# Altium schematic sheet PCIe_USB.SchDoc: PCIe_USB
size A3; Author: Silard Gal; SheetNumber: 4; SheetTotal: 7
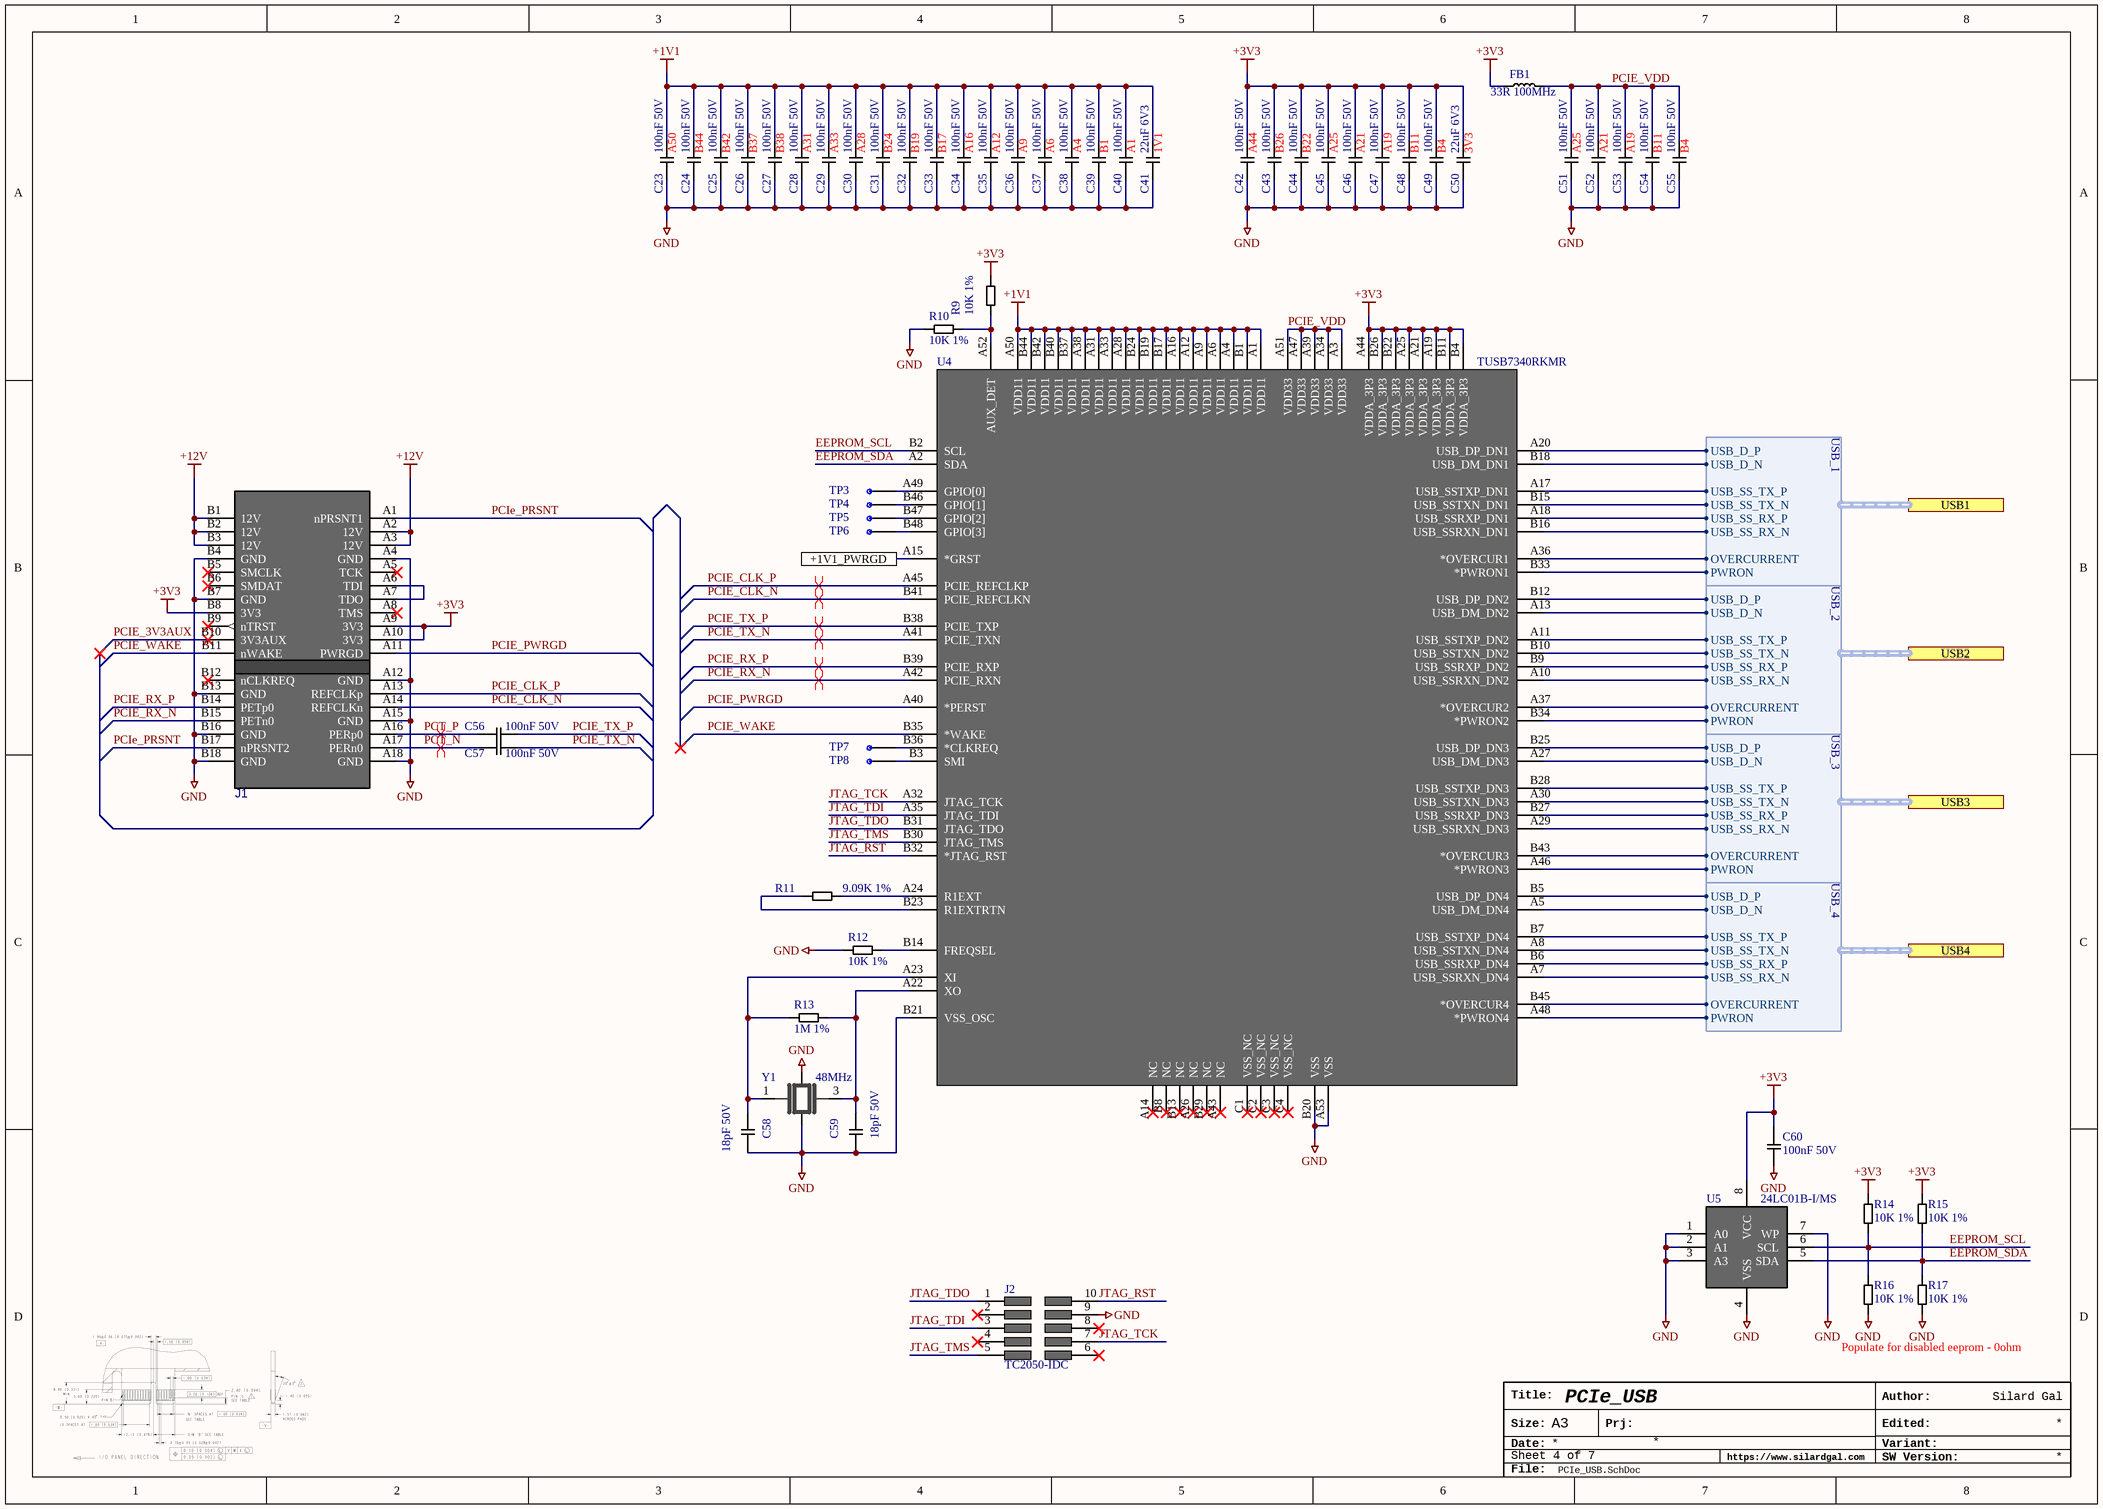
[diagram p0: PCIe_USB.SchDoc]

## Parts
C23  100nF 50V  [CAPC1608X06N]
C24  100nF 50V  [CAPC1608X06N]
C25  100nF 50V  [CAPC1608X06N]
C26  100nF 50V  [CAPC1608X06N]
C27  100nF 50V  [CAPC1608X06N]
C28  100nF 50V  [CAPC1608X06N]
C29  100nF 50V  [CAPC1608X06N]
C30  100nF 50V  [CAPC1608X06N]
C31  100nF 50V  [CAPC1608X06N]
C32  100nF 50V  [CAPC1608X06N]
C33  100nF 50V  [CAPC1608X06N]
C34  100nF 50V  [CAPC1608X06N]
C35  100nF 50V  [CAPC1608X06N]
C36  100nF 50V  [CAPC1608X06N]
C37  100nF 50V  [CAPC1608X06N]
C38  100nF 50V  [CAPC1608X06N]
C39  100nF 50V  [CAPC1608X06N]
C40  100nF 50V  [CAPC1608X06N]
C41  22uF 6V3  [CAPC1608X06N]
C42  100nF 50V  [CAPC1608X06N]
C43  100nF 50V  [CAPC1608X06N]
C44  100nF 50V  [CAPC1608X06N]
C45  100nF 50V  [CAPC1608X06N]
C46  100nF 50V  [CAPC1608X06N]
C47  100nF 50V  [CAPC1608X06N]
C48  100nF 50V  [CAPC1608X06N]
C49  100nF 50V  [CAPC1608X06N]
C50  22uF 6V3  [CAPC1608X06N]
C51  100nF 50V  [CAPC1608X06N]
C52  100nF 50V  [CAPC1608X06N]
C53  100nF 50V  [CAPC1608X06N]
C54  100nF 50V  [CAPC1608X06N]
C55  100nF 50V  [CAPC1608X06N]
C56  100nF 50V  [CAPC1005X06N]
C57  100nF 50V  [CAPC1005X06N]
C58  18pF 50V  [CAPC1608X06N]
C59  18pF 50V  [CAPC1608X06N]
C60  100nF 50V  [CAPC1608X06N]
FB1  33R 100MHz  [INDC1608X06N]
J1  PCIe x1  [CON FINGERS PCIEx1 1mm 36P PCB]  (value not drawn)  (no BOM)
J2  TC2050-IDC  [TAG_CONNECT]
R9  10K 1%  [RESC1608X06N]
R10  10K 1%  [RESC1608X06N]
R11  9.09K 1%  [RESC1608X06N]
R12  10K 1%  [RESC1608X06N]
R13  1M 1%  [RESC1608X06N]
R14  10K 1%  [RESC1608X06N]
R15  10K 1%  [RESC1608X06N]
R16  10K 1%  [RESC1608X06N]
R17  10K 1%  [RESC1608X06N]
TP3  TP  [TP]  (value not drawn)  (no BOM)
TP4  TP  [TP]  (value not drawn)  (no BOM)
TP5  TP  [TP]  (value not drawn)  (no BOM)
TP6  TP  [TP]  (value not drawn)  (no BOM)
TP7  TP  [TP]  (value not drawn)  (no BOM)
TP8  TP  [TP]  (value not drawn)  (no BOM)
U4  TUSB7340RKMR  [100-WQFN]
U5  24LC01B-I/MS  [SOP65P490X110-8N]
Y1  48MHz  [XTAL_ABM8G-48.000MHZ-18-D2Y-T]

## Ports
+1V1_PWRGD, USB1 (harness USB_1), USB2 (harness USB_2), USB3 (harness USB_3), USB4 (harness USB_4)

## Harnesses
USB_1: USB_D_P, USB_D_N, USB_SS_TX_P, USB_SS_TX_N, USB_SS_RX_P, USB_SS_RX_N, OVERCURRENT, PWRON
USB_2: USB_D_P, USB_D_N, USB_SS_TX_P, USB_SS_TX_N, USB_SS_RX_P, USB_SS_RX_N, OVERCURRENT, PWRON
USB_3: USB_D_P, USB_D_N, USB_SS_TX_P, USB_SS_TX_N, USB_SS_RX_P, USB_SS_RX_N, OVERCURRENT, PWRON
USB_4: USB_D_P, USB_D_N, USB_SS_TX_P, USB_SS_TX_N, USB_SS_RX_P, USB_SS_RX_N, OVERCURRENT, PWRON

## Nets
+1V1: C23.2 C24.2 C25.2 C26.2 C27.2 C28.2 C29.2 C30.2 C31.2 C32.2 C33.2 C34.2 C35.2 C36.2 C37.2 C38.2 C39.2 C40.2 C41.2 U4.A1(VDD11) U4.A4(VDD11) U4.A6(VDD11) U4.A9(VDD11) U4.A12(VDD11) U4.A16(VDD11) U4.A28(VDD11) U4.A31(VDD11) U4.A33(VDD11) U4.A38(VDD11) U4.A50(VDD11) U4.B1(VDD11) U4.B17(VDD11) U4.B19(VDD11) U4.B24(VDD11) U4.B37(VDD11) U4.B40(VDD11) U4.B42(VDD11) U4.B44(VDD11)
+3V3: C42.2 C43.2 C44.2 C45.2 C46.2 C47.2 C48.2 C49.2 C50.2 C60.1 FB1.1 J1.A9(3V3) J1.A10(3V3) J1.B8(3V3) R9.2 R14.1 R15.1 U4.A19(VDDA_3P3) U4.A21(VDDA_3P3) U4.A25(VDDA_3P3) U4.A44(VDDA_3P3) U4.B4(VDDA_3P3) U4.B11(VDDA_3P3) U4.B22(VDDA_3P3) U4.B26(VDDA_3P3) U5.8(VCC)
+12V: J1.A2(12V) J1.A3(12V) J1.B1(12V) J1.B2(12V) J1.B3(12V)
GND: C23.1 C24.1 C25.1 C26.1 C27.1 C28.1 C29.1 C30.1 C31.1 C32.1 C33.1 C34.1 C35.1 C36.1 C37.1 C38.1 C39.1 C40.1 C41.1 C42.1 C43.1 C44.1 C45.1 C46.1 C47.1 C48.1 C49.1 C50.1 C51.1 C52.1 C53.1 C54.1 C55.1 C58.1 C59.1 C60.2 J1.A4(GND) J1.A12(GND) J1.A15(GND) J1.A18(GND) J1.B4(GND) J1.B7(GND) J1.B13(GND) J1.B16(GND) J1.B18(GND) J2.9 R10.2 R12.2 R16.2 R17.2 U4.A53(VSS) U4.B20(VSS) U4.B21(VSS_OSC) U5.1(A0) U5.2(A1) U5.3(A3) U5.4(VSS) U5.7(WP) Y1.2(GND) Y1.4(GND)
+1V1_PWRGD: U4.A15(*GRST) ; port +1V1_PWRGD
EEPROM_SCL: R14.2 R16.1 U4.B2(SCL) U5.6(SCL)
EEPROM_SDA: R15.2 R17.1 U4.A2(SDA) U5.5(SDA)
JTAG_RST: J2.10 U4.B32(*JTAG_RST)
JTAG_TCK: J2.7 U4.A32(JTAG_TCK)
JTAG_TDI: J2.3 U4.A35(JTAG_TDI)
JTAG_TDO: J2.1 U4.B31(JTAG_TDO)
JTAG_TMS: J2.5 U4.B30(JTAG_TMS)
PCIE_3V3AUX: J1.B10(3V3AUX)
PCIE_CLK_N: J1.A14(REFCLKn) U4.B41(PCIE_REFCLKN)
PCIE_CLK_P: J1.A13(REFCLKp) U4.A45(PCIE_REFCLKP)
PCIe_PRSNT: J1.A1(nPRSNT1) J1.B17(nPRSNT2)
PCIE_PWRGD: J1.A11(PWRGD) U4.A40(*PERST)
PCIE_RX_N: J1.B15(PETn0) U4.A42(PCIE_RXN)
PCIE_RX_P: J1.B14(PETp0) U4.B39(PCIE_RXP)
PCIE_TX_N: C57.2 U4.A41(PCIE_TXN)
PCIE_TX_P: C56.2 U4.B38(PCIE_TXP)
PCIE_VDD: C51.2 C52.2 C53.2 C54.2 C55.2 FB1.2 U4.A3(VDD33) U4.A34(VDD33) U4.A39(VDD33) U4.A47(VDD33) U4.A51(VDD33)
PCIE_WAKE: J1.B11(nWAKE) U4.B35(*WAKE)
PCT_N: C57.1 J1.A17(PERn0)
PCT_P: C56.1 J1.A16(PERp0)
NetC58_2: C58.2 R13.1 U4.A23(XI) Y1.1
NetC59_2: C59.2 R13.2 U4.A22(XO) Y1.3
NetJ1_A6: J1.A6(TDI) J1.A7(TDO)
NetR9_1: R9.1 R10.1 U4.A52(AUX_DET)
NetR11_1: R11.1 U4.B23(R1EXTRTN)
NetR11_2: R11.2 U4.A24(R1EXT)
NetR12_1: R12.1 U4.B14(FREQSEL)
NetTP3_1: TP3.1 U4.A49(GPIO[0])
NetTP4_1: TP4.1 U4.B46(GPIO[1])
NetTP5_1: TP5.1 U4.B47(GPIO[2])
NetTP6_1: TP6.1 U4.B48(GPIO[3])
NetTP7_1: TP7.1 U4.B36(*CLKREQ)
NetTP8_1: TP8.1 U4.B3(SMI)
NetU4_A5: U4.A5(USB_DM_DN4) ; port USB4.USB_D_N
NetU4_A7: U4.A7(USB_SSRXN_DN4) ; port USB4.USB_SS_RX_N
NetU4_A8: U4.A8(USB_SSTXN_DN4) ; port USB4.USB_SS_TX_N
NetU4_A10: U4.A10(USB_SSRXN_DN2) ; port USB2.USB_SS_RX_N
NetU4_A11: U4.A11(USB_SSTXP_DN2) ; port USB2.USB_SS_TX_P
NetU4_A13: U4.A13(USB_DM_DN2) ; port USB2.USB_D_N
NetU4_A17: U4.A17(USB_SSTXP_DN1) ; port USB1.USB_SS_TX_P
NetU4_A18: U4.A18(USB_SSRXP_DN1) ; port USB1.USB_SS_RX_P
NetU4_A20: U4.A20(USB_DP_DN1) ; port USB1.USB_D_P
NetU4_A27: U4.A27(USB_DM_DN3) ; port USB3.USB_D_N
NetU4_A29: U4.A29(USB_SSRXN_DN3) ; port USB3.USB_SS_RX_N
NetU4_A30: U4.A30(USB_SSTXN_DN3) ; port USB3.USB_SS_TX_N
NetU4_A36: U4.A36(*OVERCUR1) ; port USB1.OVERCURRENT
NetU4_A37: U4.A37(*OVERCUR2) ; port USB2.OVERCURRENT
NetU4_A46: U4.A46(*PWRON3) ; port USB3.PWRON
NetU4_A48: U4.A48(*PWRON4) ; port USB4.PWRON
NetU4_B5: U4.B5(USB_DP_DN4) ; port USB4.USB_D_P
NetU4_B6: U4.B6(USB_SSRXP_DN4) ; port USB4.USB_SS_RX_P
NetU4_B7: U4.B7(USB_SSTXP_DN4) ; port USB4.USB_SS_TX_P
NetU4_B9: U4.B9(USB_SSRXP_DN2) ; port USB2.USB_SS_RX_P
NetU4_B10: U4.B10(USB_SSTXN_DN2) ; port USB2.USB_SS_TX_N
NetU4_B12: U4.B12(USB_DP_DN2) ; port USB2.USB_D_P
NetU4_B15: U4.B15(USB_SSTXN_DN1) ; port USB1.USB_SS_TX_N
NetU4_B16: U4.B16(USB_SSRXN_DN1) ; port USB1.USB_SS_RX_N
NetU4_B18: U4.B18(USB_DM_DN1) ; port USB1.USB_D_N
NetU4_B25: U4.B25(USB_DP_DN3) ; port USB3.USB_D_P
NetU4_B27: U4.B27(USB_SSRXP_DN3) ; port USB3.USB_SS_RX_P
NetU4_B28: U4.B28(USB_SSTXP_DN3) ; port USB3.USB_SS_TX_P
NetU4_B33: U4.B33(*PWRON1) ; port USB1.PWRON
NetU4_B34: U4.B34(*PWRON2) ; port USB2.PWRON
NetU4_B43: U4.B43(*OVERCUR3) ; port USB3.OVERCURRENT
NetU4_B45: U4.B45(*OVERCUR4) ; port USB4.OVERCURRENT

Not connected (* = marked no-connect by the designer): J1 A5(TCK)* A8(TMS)* B5(SMCLK)* B6(SMDAT)* B9(nTRST)* B12(nCLKREQ)*; J2 2* 4* 6* 8*; U4 A14(NC)* A26(NC)* A43(NC)* B8(NC)* B13(NC)* B29(NC)* C1(VSS_NC)* C2(VSS_NC)* C3(VSS_NC)* C4(VSS_NC)*

## Layout directives
differential pair: PCIE_CLK_N, PCIE_CLK_P, PCIE_RX_N, PCIE_RX_P, PCIE_TX_N, PCIE_TX_P, PCT_N, PCT_P

## Notes on the sheet
- (near C23) A50
- (near C24) B44
- (near C25) B42
- (near C26) B37
- (near C27) B38
- (near C28) A31
- (near C29) A33
- (near C30) A28
- (near C31) B24
- (near C32) B19
- (near C33) B17
- (near C34) A16
- (near C35) A12
- (near C36) A9
- (near C37) A6
- (near C38) A4
- (near C39) B1
- (near C40) A1
- (near C41) 1V1
- (near C42) A44
- (near C43) B26
- (near C44) B22
- (near C45) A25
- (near C46) A21
- (near C47) A19
- (near C48) B11
- (near C49) B4
- (near C50) 3V3
- (near C51) A25
- (near C52) A21
- (near C53) A19
- (near C54) B11
- (near C55) B4
- Populate for disabled eeprom - 0ohm
- Title:
- Author:
- Size:
- Date:
- A3
- Prj:
- https://www.silardgal.com
- SW Version:
- Variant:
- Edited:
- File:

## Library data of the parts
C23-C40 C42-C49 C51-C55 C60 = 100nF 50V: 0.1 µF ±10% 50V Ceramic Capacitor X7R 0603 (1608 Metric); MPN: GCM188R71H104KA57D
C41 C50 = 22uF 6V3: 22 µF ±20% 6.3V Ceramic Capacitor X5R 0603 (1608 Metric); MPN: GRM188R60J226MEA0D
C56 C57 = 100nF 50V_1: 0.1 µF ±10% 16V Ceramic Capacitor X7R 0402 (1005 Metric); MPN: GRM155R71C104KA88J
C58 C59 = 18pF 50V: CAP CER 18PF 50V C0G/NP0 0603; MPN: GRM1885C1H180JA01D
FB1 = 33R 100MHz: 33 Ohms @ 100 MHz 1 Power Line Ferrite Bead 0603 (1608 Metric) 3A 25mOhm; MPN: BLM18PG330SN1D
J1 = CON_Edge_PCB_PCIe_x1_36P: Connector, PCB Edge, plug 2x18 positions, 1.0mm pitch; ComponentLink1URL: http://nyusperforce.smsc.com//depot_np_hweng_boards/altium_libraries/datasheets/TE_Connectivity (Amp_Tyco)/ENG_CD_5179031_A4.pdfHirose/DF12_catalog.pdf
R9 R10 R12 R14-R17 = 10K 1%: 10 kOhms ±1% 0.1W, 1/10W Chip Resistor 0603 (1608 Metric) Automotive AEC-Q200 Thick Film; MPN: ERJ-3EKF1002V
R11 = 9.09K 1%: 9.09 kOhms ±1% 0.1W, 1/10W Chip Resistor 0603 (1608 Metric) Automotive AEC-Q200 Thick Film; MPN: ERJ-3EKF9091V
R13 = 1M 1%: RES SMD 1M OHM 1% 1/10W 0603; MPN: ERJ-3EKF1004V
U4 = TUSB7340RKMR: USB Host Controller USB 3.0 USB, PCIe Interface 100-WQFN-MR (9x9)
U5 = 24LC01B-I/MS: EEPROM Memory IC 1Kbit I2C 400 kHz 3.5 µs 8-MSOP; MPN: 24LC01B-I/MS
Y1 = ABM8G-48.000MHZ-18-D2Y-T: 48 MHz ±20ppm Crystal 18pF 50 Ohms 4-SMD, No Lead; MPN: ABM8G-48.000MHZ-18-D2Y-T
J2 = TC2050-IDC: MPN: TC2050-IDC